# EAGLE design tomu-pro-micro2 (EAGLE 9.0.1)
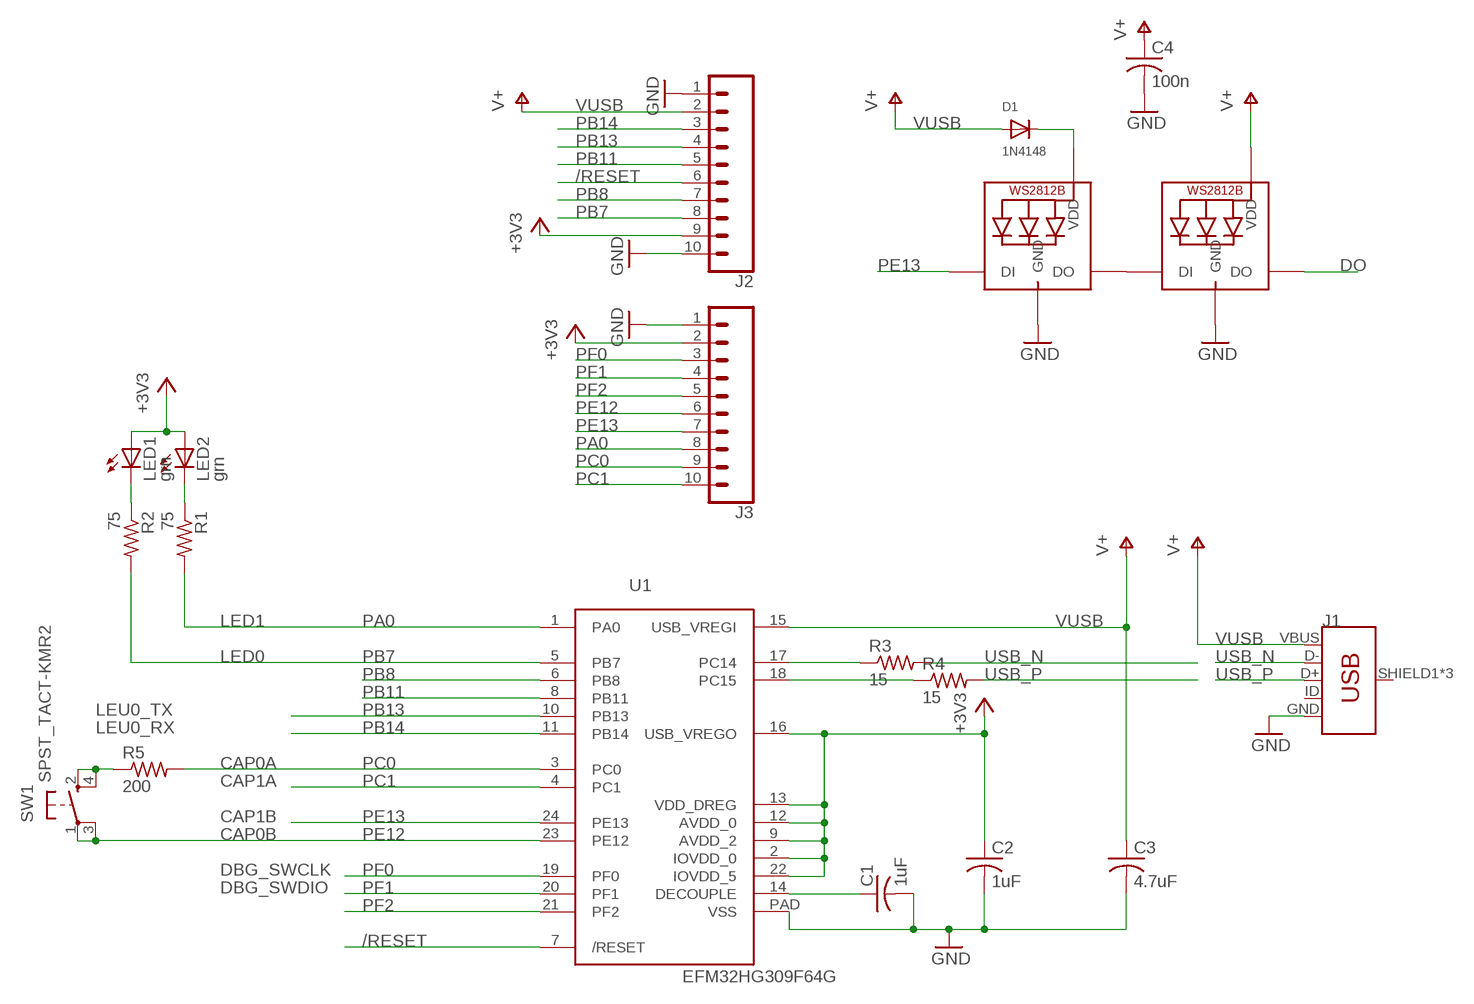
[diagram p0: schematic, sheet 1]

## Parts
C1  1uF  C-USC0603  [C0603]
C2  1uF  C-USC0603  [C0603]
C3  4.7uF  C-USC0603  [C0603]
C4  100n  C-USC0603  [C0603]
D1  1N4148  DIODESOD-323F  [SOD-323F]
J1  USB_MICRO-B_FEMALE-SMT  [USB-B-MICRO-SMD]
J2  CONN_10"  [1X10]
J3  CONN_10"  [1X10]
L1  WS2812B3535  [LED3535]
L2  WS2812B3535  [LED3535]
LED1  grn  LEDCHIP-LED0603  [CHIP-LED0603]
LED2  grn  LEDCHIP-LED0603  [CHIP-LED0603]
R1  75  R-US_R0603  [R0603]
R2  75  R-US_R0603  [R0603]
R3  15  R-US_R0603  [R0603]
R4  15  R-US_R0603  [R0603]
R5  200  R-US_R0603  [R0603]
SW1  SPST_TACT-KMR2  [KMR2]
U1  EFM32HG309F64G  [QFN24PAD]

## Nets
+3V3: C2.1 J2.9 J3.2 LED1.A LED2.A U1.2(IOVDD_0) U1.9(AVDD_2) U1.12(AVDD_0) U1.13(VDD_DREG) U1.16(USB_VREGO) U1.22(IOVDD_5)
/RESET: J2.6 U1.7(/RESET)
DECOUPLE: C1.1 U1.14(DECOUPLE)
DO: L2.3(DO)
GND: C1.2 C2.2 C3.2 C4.2 J1.GND J2.1 J2.10 J3.1 L1.4(GND) L2.4(GND) U1.PAD(VSS)
N$1: L1.3(DO) L2.1(DI)
N$2: D1.C L1.2(VDD)
N$4: LED1.C R2.1
N$5: LED2.C R1.1
N$20: R5.1 SW1.2(S) SW1.4(S1)
PA0: J3.8 R1.2 U1.1(PA0)
PB7: J2.8 R2.2 U1.5(PB7)
PB8: J2.7 U1.6(PB8)
PB11: J2.5 U1.8(PB11)
PB13: J2.4 U1.10(PB13)
PB14: J2.3 U1.11(PB14)
PC0: J3.9 R5.2 U1.3(PC0)
PC1: J3.10 U1.4(PC1)
PE12: J3.6 SW1.1(P) SW1.3(P1) U1.23(PE12)
PE13: J3.7 L1.1(DI) U1.24(PE13)
PF0: J3.3 U1.19(PF0)
PF1: J3.4 U1.20(PF1)
PF2: J3.5 U1.21(PF2)
RUSB_N: R3.1 U1.17(PC14)
RUSB_P: R4.1 U1.18(PC15)
USB_N: J1.D- R3.2
USB_P: J1.D+ R4.2
VUSB: C3.1 C4.1 D1.A J1.VBUS J2.2 L2.2(VDD) U1.15(USB_VREGI) ; supply symbol labelled V+
Unconnected: J1.ID J1.SHIELD1(SHIELD) J1.SHIELD2(SHIELD) J1.SHIELD3(SHIELD)

## Notes on the sheet
- LED1
- LED0
- LEU0_TX
- LEU0_RX
- CAP0A
- CAP1A
- CAP1B
- CAP0B
- DBG_SWCLK
- DBG_SWDIO

## Library data of the parts
C1-C4 = adafruit:C-US: CAPACITOR, American symbol
D1 = adafruit:DIODE: Diode SMADIODE - SMA Surface Mount Package 20V 1A Schottky Diode Digikey: 641-1014-6-ND DO-1N4148 - Through Hole Small Current Diode SOD-123 20V 1 A (.5mV Vf) Schottky Diode - Digikey: MBRX120TPMSCT-ND SOD-323 10V 570mA (.38mV Vf, 3ns) Schottky Diode - Digikey: ZLLS410CT-ND SOD-523 30V 30mA Schottky Diode (RB751S-40TE61) - Digikey: RB751S-40TE61CT-ND SOT23-R/W - SOT23 Package (R = Solder Paste/Reflow Ovens, W = Hand-Soldering) BAT54Film 40V 300mA - Digikey: 497-7162-1-ND
J1 = SparkFun-Connectors:USB_MICRO-B: USB Type Micro-B Connector Male/female and PTH/SMT variants SparkFun Products: SparkFun microB USB Breakout <https://www.sparkfun.com/products/12035> SparkFun USB microB Plug Breakout <https://www.sparkfun.com/products/10031> SparkFun ESP8266 Thing <https://www.sparkfun.com/products/13231>; PROD_ID: CONN-11752
J2 J3 = SparkFun-Connectors:CONN_10: Multi connection point. Often used as Generic Header-pin footprint for 0.1 inch spaced/style header connections On any of the 0.1 inch spaced packages, you can populate with these: Break Away Headers - Straight <https://www.sparkfun.com/products/116> (PRT-00116) Break Away Male Headers - Right Angle <https://www.sparkfun.com/products/553> (PRT-00553) Female Headers <https://www.sparkfun.com/products/115> (PRT-00115) Break Away Headers - Machine Pin <https://www.sparkfun.com/products/117> (PRT-00117) Break Away Female Headers - Swiss Machine Pin <https://www.sparkfun.com/products/743> (PRT-00743) Arduino Stackable Header - 10 Pin <https://www.sparkfun.com/products/11376> (PRT-11376) For SCREWTERMINALS and SPRING TERMINALS visit here: Screw Terimnals on SparkFun.com <https://www.sparkfun.com/search/results?term=Screw+Terminals> (5mm/3.5mm/2.54mm spacing) This device is also useful as a general connection point to wire up your design to another part of your project. Our various solder wires solder well into these plated through hole pads. Hook-Up Wire - Assortment (Stranded, 22 AWG) <https://www.sparkfun.com/products/11375> (PRT-11375) Hook-Up Wire - Assortment (Solid Core, 22 AWG) <https://www.sparkfun.com/products/11367> (PRT-11367) View the entire wire category on our website here <https://www.sparkfun.com/categories/141> Special notes: Molex polarized connector foot print use with SKU : PRT-08231 with associated crimp pins and housings. 1MM SMD Version SKU: PRT-10208 NOTES ON THE VARIANTS LOCK and LOCK_LONGPADS... This footprint was designed to help hold the alignment of a through-hole component (i.e. 6-pin header) while soldering it into place. You may notice that each hole has been shifted either up or down by 0.005 of an inch from it's more standard position (which is a perfectly straight line). This slight alteration caused the pins (the squares in the middle) to touch the edges of the holes. Because they are alternating, it causes a "brace" to hold the component in place. 0.005 has proven to be the perfect amount of "off-center" position when using our standard breakaway headers. Although looks a little odd when you look at the bare footprint, once you have a header in there, the alteration is very hard to notice. Also,if you push a header all the way into place, it is covered up entirely on the bottom side.; PROD_ID: CONN-11563
L1 L2 = todstuff:WS2812B
LED1 LED2 = adafruit:LED: LED OSRAM: - CHIPLED LG R971, LG N971, LY N971, LG Q971, LY Q971, LO R971, LY R971 LH N974, LH R974 LS Q976, LO Q976, LY Q976 LO Q996 - Hyper CHIPLED LW Q18S LB Q993, LB Q99A, LB R99A - SideLED LS A670, LO A670, LY A670, LG A670, LP A670 LB A673, LV A673, LT A673, LW A673 LH A674 LY A675 LS A676, LA A676, LO A676, LY A676, LW A676 LS A679, LY A679, LG A679 - Hyper Micro SIDELED® LS Y876, LA Y876, LO Y876, LY Y876 LT Y87S - SmartLED LW L88C, LW L88S LB L89C, LB L89S, LG L890 LS L89K, LO L89K, LY L89K LS L896, LA L896, LO L896, LY L896 - TOPLED LS T670, LO T670, LY T670, LG T670, LP T670 LSG T670, LSP T670, LSY T670, LOP T670, LYG T670 LG T671, LOG T671, LSG T671 LB T673, LV T673, LT T673, LW T673 LH T674 LS T676, LA T676, LO T676, LY T676, LB T676, LH T676, LSB T676, LW T676 LB T67C, LV T67C, LT T67C, LS T67K, LO T67K, LY T67K, LW E67C LS E67B, LA E67B, LO E67B, LY E67B, LB E67C, LV E67C, LT E67C LW T67C LS T679, LY T679, LG T679 LS T770, LO T770, LY T770, LG T770, LP T770 LB T773, LV T773, LT T773, LW T773 LH T774 LS E675, LA E675, LY E675, LS T675 LS T776, LA T776, LO T776, LY T776, LB T776 LHGB T686 LT T68C, LB T68C - Hyper Mini TOPLED® LB M676 - Mini TOPLED Santana® LG M470 LS M47K, LO M47K, LY M47K Source: http://www.osram.convergy.de/
R1-R5 = adafruit:R-US_: RESISTOR, American symbol
SW1 = adafruit:SPST_TACT: SMT 6mm switch, EVQQ2 series http://www.ladyada.net/library/eagle
U1 = todstuff:EFM32HG309F64G

## Board
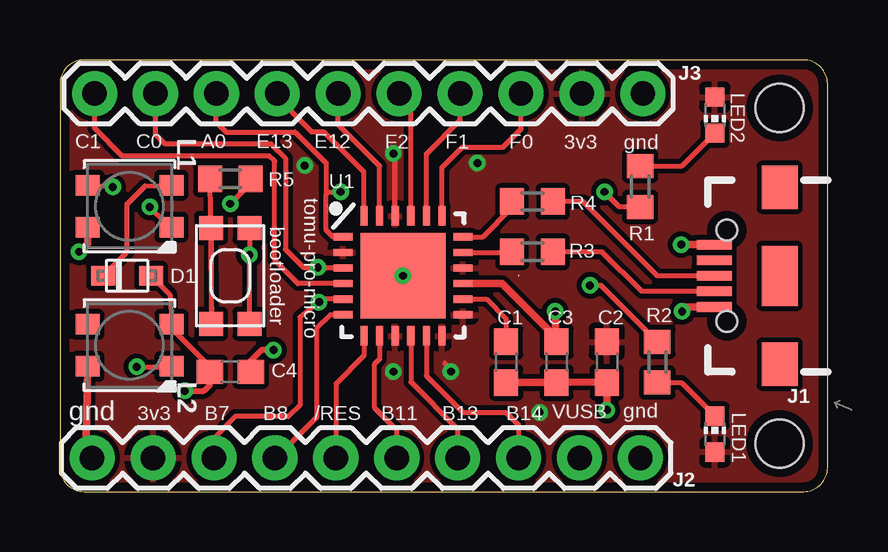
[diagram p1: board, top side]
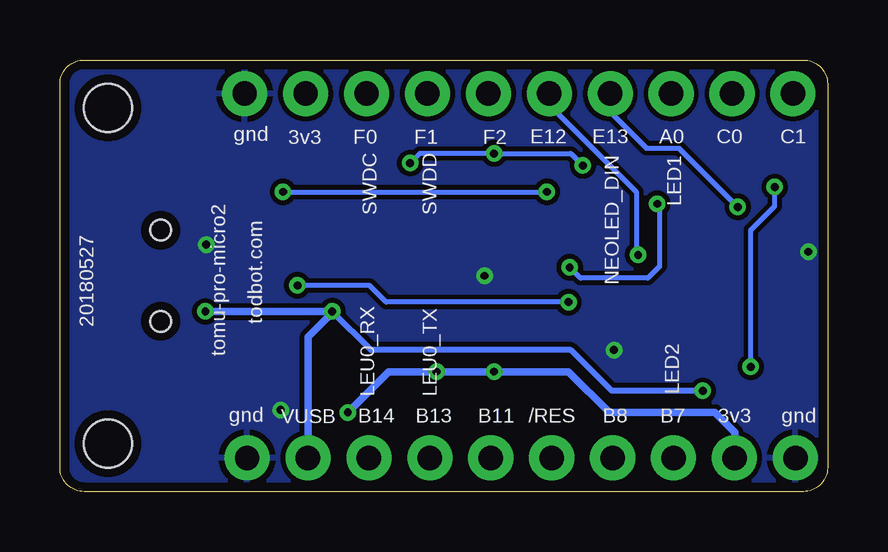
[diagram p2: board, bottom side, seen from below]

Size 32 x 18 mm. Coordinates in mm from the lower left corner, seen from the top.
Outline: 31,18 1,18 arc90 0,17 0,1 arc90 1,0 31,0 arc90 32,1 32,17 arc90 31,18
Copper layers (1*16): Top 0.0356mm / dielectric 1.5011mm / Bottom 0.0356mm
Design rules "LaenPCBOrderTodTent8mil": minimum track width 8mil, minimum drill 13mil, track to track 8mil, track to pad 8mil, pad to pad 8mil, via to via 8mil, smd to smd 8mil, copper to edge 15mil, drill to drill 8mil, minimum pad ring 7mil, minimum via ring 7mil, stop-mask expansion 3mil, vias tented up to drill 20mil, thermal gap 10mil
Holes 2 mm at 30,16 30,2

### Footprints (pad centres in the part's own frame; a part is rotated, then mirrored left to right if it is on the bottom)
C0603 = smd 1.1 x 1: 1 -0.85,0; 2 0.85,0
SOD-323F = smd 1 x 0.8: A -1,0; C 1,0
USB-B-MICRO-SMD = smd 1.45 x 0.4: D+ 2.725,0; D- 2.725,0.65; GND 2.725,-1.3; ID 2.725,-0.65; VBUS 2.725,1.3 | smd 1.5 x 1.8: SHIELD1 0,3.685; SHIELD2 0,-3.685 | smd 1.5 x 2.5: SHIELD3 0,0 | hole 0.85: 2.2,1.9; 2.2,-1.9
1X10 = drill 1.016 pad 1.88: 1 0,0; 2 2.54,0; 3 5.08,0; 4 7.62,0; 5 10.16,0; 6 12.7,0; 7 15.24,0; 8 17.78,0; 9 20.32,0; 10 22.86,0
LED3535 = smd 1 x 0.85: 1 -1.75,0.875; 2 -1.75,-0.875; 3 1.75,-0.875; 4 1.75,0.875
CHIP-LED0603 = smd 0.8 x 0.8: A 0,-0.75; C 0,0.75
R0603 = smd 1 x 1.1: 1 -0.85,0; 2 0.85,0
KMR2 = smd 1 x 1: 1 2,0.8; 2 2,-0.8; 3 -2,0.8; 4 -2,-0.8
QFN24PAD = smd 0.8 x 0.3: 1 -2.5,1.625; 2 -2.5,0.975; 3 -2.5,0.325; 4 -2.5,-0.325; 5 -2.5,-0.975; 6 -2.5,-1.625; 13 2.5,-1.625; 14 2.5,-0.975; 15 2.5,-0.325; 16 2.5,0.325; 17 2.5,0.975; 18 2.5,1.625 | smd 0.3 x 0.8: 7 -1.625,-2.5; 8 -0.975,-2.5; 9 -0.325,-2.5; 10 0.325,-2.5; 11 0.975,-2.5; 12 1.625,-2.5; 19 1.625,2.5; 20 0.975,2.5; 21 0.325,2.5; 22 -0.325,2.5; 23 -0.975,2.5; 24 -1.625,2.5 | smd 3.55 x 3.55: PAD 0,0

### Placement (x,y rotation side)
C1  18.6,5.4 270 top
C2  22.8,5.4 270 top
C3  20.7,5.4 270 top
C4  7.1,5 0 top
D1  2.8,9 180 top
J1  30,9 180 top
J2  24.2,1.4 180 top
J3  24.3,16.6 180 top
L1  2.9,11.9 180 top
L2  2.9,6.1 180 top
LED1  27.3,2.4 0 top
LED2  27.3,15.7 180 top
R1  24.19,12.72 270 top
R2  24.9,5.4 90 top
R3  19.7,10 0 top
R4  19.7,12.1 0 top
R5  7.1,13.04 0 top
SW1  7.1,9 270 top
U1  14.3,9 0 top

### Tracks (layer width: path | path; a pad name or v marks a point on that pad's centre or on a via)
+3V3  (via drill 0.33)
  Top 0.203: 13.95,5.05 v13.9,5 | v16.3,5 16.05,5.35 | U1.22 13.98,13.72
  Bottom 0.203: v10.2,13.6 10.7,14.1 v13.9,14.1 17,14.1 v17.4,13.7
  Bottom 0.305: J2.9 3.87,2.47 4.7,3.3 9.1,3.3 10.8,5 v13.9,5 v16.3,5 18.3,5 v20,3.3
  pour Top: -1.15,18.87 33.04,18.87 33.04,-0.94 -1.15,-0.94
/RESET
  Top 0.203: J2.6 11.5,4.5 12.68,5.67 U1.7
DECOUPLE
  Top 0.203: C1.1 18.6,7.2 17.78,8.03 U1.14
GND  (via drill 0.33)
  Top 0.203: C2.2 22.34,4.56 | J2.10 1.09,1.65 1.09,2.09 | 26,10.3 25.95,10.25 | C4.2 8.05,5.1
  Top 0.254: v8.9,5.9 8.4,5.9 7.95,5.45 C4.2 8,5.05
  Top 0.305: C1.2 C3.2 22.34,4.56 | v22.8,3.4 C2.2 | 25.95,10.25 v25.9,10.3 | 1.09,2.09 L2.4 | J1.GND 26,10.3 | v0.8,10 1.15,10.35 L1.4
  other vias: 14.3,9
  pour Bottom: -1.05,-1.33 -1.1,19.15 33.37,19.15 33.42,-1.33
N$1  (via drill 0.33)
  Top 0.203: v3.2,5.2 4.59,5.2 L2.1 | L1.3 2.16,12.74 v2.2,12.7
  Bottom 0.203: v2.2,12.7 2.2,11.9 3.2,10.9 v3.2,5.2
N$2
  Top 0.203: D1.C 2.8,10 2.8,12 3.54,12.74 L1.2
N$4
  Top 0.203: R2.1 25.9,4.55 LED1.C
N$5
  Top 0.203: LED2.C 25.92,13.57 R1.1
N$20
  Top 0.203: SW1.4 SW1.2 6.35,6.95 R5.1
PA0  (via drill 0.33)
  Top 0.203: v22.7,12.5 23.33,11.87 R1.2 | v11.7,12.5 11.68,12.46 11.16,12.46 11.1,12.4 | J3.8 6.52,15.4 6.92,15 9.8,15 11.1,13.7 11.1,12.4 | 11.1,12.4 11.1,10.9 11.38,10.62 U1.1
  Bottom 0.203: v22.7,12.5 v11.7,12.5
PB7  (via drill 0.33)
  Top 0.203: v22.1,8.6 22.55,8.6 R2.2 | J2.8 6.42,2.25 7.3,3.13 9.53,3.13 10,3.6 10,7.27 v10.8,7.9 10.93,8.03 U1.5
  Bottom 0.203: v10.8,7.9 18.4,7.9 19.1,8.6 v22.1,8.6
PB8
  Top 0.203: J2.7 9,1.4 10.7,3.1 10.7,6.8 11.28,7.38 U1.6
PB11
  Top 0.203: J2.5 14.03,2.58 13.1,3.51 13.1,5.3 13.33,5.53 U1.8
PB13
  Top 0.203: J2.4 16.58,2.61 14.62,4.57 U1.10
PB14
  Top 0.203: J2.3 19.11,2.79 18.6,3.3 16.8,3.3 15.28,4.83 U1.11
PC0  (via drill 0.33)
  Top 0.203: R5.2 7.95,12.85 v7.1,12 | J3.9 3.98,14.89 4.38,14.49 8.81,14.49 9.4,13.9 9.4,10.1 10.15,9.35 v10.75,9.35 10.78,9.32 U1.3
  Bottom 0.203: v7.1,12 7,11.9 7,9.4 7.5,8.9 10.3,8.9 v10.75,9.35
PC1
  Top 0.203: U1.4 9.93,8.68 8.95,9.65 8.95,13.78 8.73,14 2.6,14 1.44,15.16 J3.10
PE12  (via drill 0.33)
  Top 0.203: SW1.1 v7.9,9.87 SW1.3 | 11.6,16.54 J3.6 11.6,15.3 13.33,13.57 U1.23
  Bottom 0.203: v7.9,9.87 7.96,9.94 7.96,12.48 11.6,16.12 J3.6
PE13  (via drill 0.33)
  Top 0.203: 10.5,15 11,15 12.68,13.32 U1.24 | 10.5,15 10.47,15 | 4.5,11.05 L1.1 3.74,11.81 v3.74,11.87 | 10.5,15 9.06,16.44 J3.7
  Bottom 0.203: v3.74,11.87 6.19,14.32 7.55,14.32 9.06,15.83 J3.7
PF0
  Top 0.203: J3.3 19.22,15.11 18.48,14.36 16.78,14.36 15.93,13.51 U1.19
PF1
  Top 0.203: J3.4 16.68,15.48 15.28,14.07 U1.20
PF2
  Top 0.203: J3.5 14.52,16.22 14.62,16.12 | 14.62,16.12 14.63,16.11 | U1.21 14.62,16.12
RUSB_N
  Top 0.203: 18.8,10.05 R3.1 18.83,9.97 U1.17
RUSB_P
  Top 0.203: 18.55,11.93 R4.1 18.85,11.85 17.62,10.62 U1.18
USB_N
  Top 0.203: R3.2 22.6,10 24.25,8.35 J1.D-
USB_P
  Top 0.203: R4.2 21.8,12.1 24.9,9 J1.D+
VUSB  (via drill 0.33)
  Top 0.203: 20.7,6.4 C3.1 20.65,6.3 | 26.12,7.7 v25.94,7.51 | D1.A 4.59,8.21 L2.2 4.59,6.86 6.25,5.2 C4.1
  Top 0.254: 6.25,5.2 C4.1 6.25,4.45 6,4.2 v5.2,4.2
  Top 0.305: 20.65,6.3 v20.65,7.52 | J1.VBUS 26.12,7.7 | U1.15 18.43,8.68 20.7,6.4
  Bottom 0.203: 20.65,7.4 20.65,7.45 v20.65,7.52 v20.66,7.51
  Bottom 0.254: v5.2,4.2 9,4.2 10.7,5.9 19.03,5.9 v20.65,7.52
  Bottom 0.305: J2.2 21.65,6.45 20.65,7.45 | v25.94,7.51 v20.66,7.51

### Text on the board
tPlace: C1 | C0 | A0 | E13 | E12 | F2 | F1 | F0 | 3v3 | gnd | tomu-pro-micro | bootloader | gnd | 3v3 | B7 | B8 | /RES | B11 | B13 | B14 | VUSB | gnd
bPlace: C1 | C0 | A0 | E13 | E12 | F1 | F0 | 3v3 | gnd | LED1 | NEOLED_DIN | F2 | SWDD | SWDC | todbot.com | 20180527 | tomu-pro-micro2 | LED2 | LEU0_TX | LEU0_RX | gnd | 3v3 | B7 | B8 | /RES | B11 | B13 | B14 | VUSB | gnd